# EAGLE design QuadGPS-v0.1 (EAGLE 5.06)
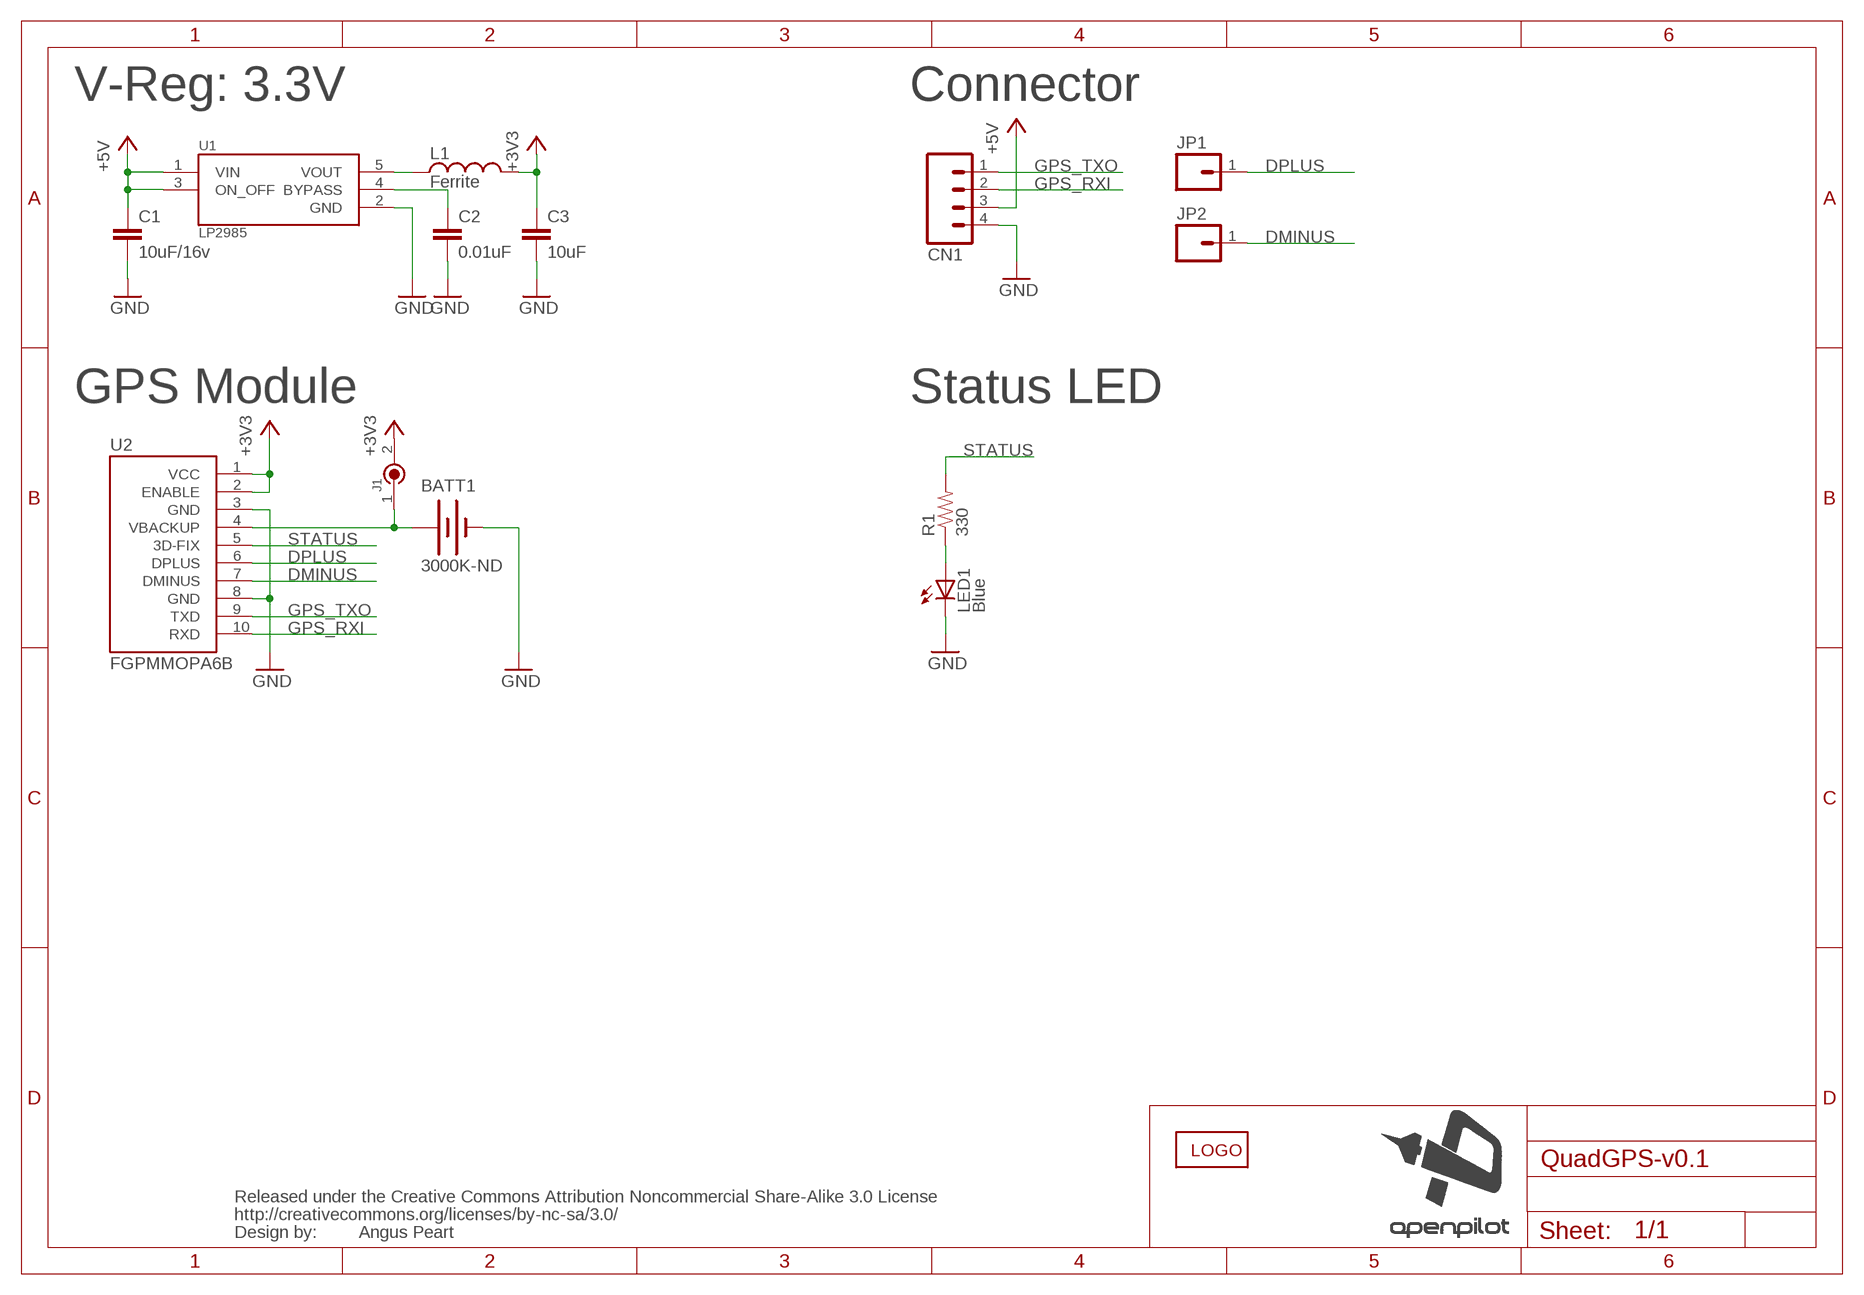
[diagram p0: schematic, sheet 1]

## Parts
BATT1  3000K-ND  BATTERY12MM-SMD  [COINCELL_12MM]
C1  10uF/16v  CAPACITOR0805  [0805]
C2  0.01uF  CAPACITOR0603  [0603]
C3  10uF  CAPACITOR0805  [0805]
CC  CREATIVE_COMMONS  [CREATIVE_COMMONS]
CN1  SM04B-SRSS-TB  [SM04B-SRSS-TB]
J1  JUMPER-ROUND  [JUMPER-ROUND]
JP1  PAD-0.06  [PAD-0.06]
JP2  PAD-0.06  [PAD-0.06]
L1  Ferrite  INDUCTOR0603  [0603]
LED1  Blue  LED0603  [LED-0603]
R1  330  RESISTOR0603  [0603]
U1  LP2985  [SOT-23-5]
U2  FGPMMOPA6B  [GTOP-FGPMMOPA6B]
U$1  LOGO_BRD_GPS_BOT  [LOGO-GPS-BOT]

## Nets
+3V3: C3.1 J1.2 L1.2 U2.1(VCC) U2.2(ENABLE)
+5V: C1.1 CN1.3 U1.1(VIN) U1.3(ON_OFF)
DMINUS: JP2.1 U2.7(DMINUS)
DPLUS: JP1.1 U2.6(DPLUS)
GND: BATT1.GND(-) C1.2 C2.2 C3.2 CN1.4 LED1.C U1.2(GND) U2.3(GND) U2.8(GND)
GPS_RXI: CN1.2 U2.10(RXD)
GPS_TXO: CN1.1 U2.9(TXD)
N$1: BATT1.PWR@1(+) J1.1 U2.4(VBACKUP)
N$2: C2.1 U1.4(BYPASS)
N$3: L1.1 U1.5(VOUT)
N$4: LED1.A R1.1
STATUS: R1.2 U2.5(3D-FIX)

## Notes on the sheet
- V-Reg: 3.3V | Connector
- GPS Module | Status LED
- Angus Peart

## Library data of the parts
BATT1 = OpenPilot:BATTERY: Battery 12mm coin cell
C1-C3 = OpenPilot:CAPACITOR: Capacitor Standard SMD ceramic capacitors.
CC = OpenPilot:CREATIVE_COMMONS: Creative Commons Licenses http://creativecommons.org/licenses/
CN1 = OpenPilot:SM04B-SRSS-TB: JST SR Connector 4 pins, SMT (Side entry)
J1 = OpenPilot:JUMPER: Simple Solder Jumpers
JP1 JP2 = OpenPilot:PAD-
L1 = OpenPilot:INDUCTOR
LED1 = OpenPilot:LED: Standard packages for surface mount Light Emitting Diodes (LEDs).
R1 = OpenPilot:RESISTOR: Resistor Basic schematic elements and footprints for 0603 resistors.
U1 = OpenPilot:LP2985: National Semiconductor LP2985 Micropower 150 mA Low-Noise Ultra Low-Dropout Regulator in SOT-23 and micro SMD Packages
U2 = OpenPilot:FGPMMOPA6B: GTOP FGPMMOPA6B GPS POT (Patch-On-Top) Module 66-channel GPS Engine Board
U$1 = OpenPilot:LOGO_BRD: Various logos used in the OpenPilot PCB designs.

## Board
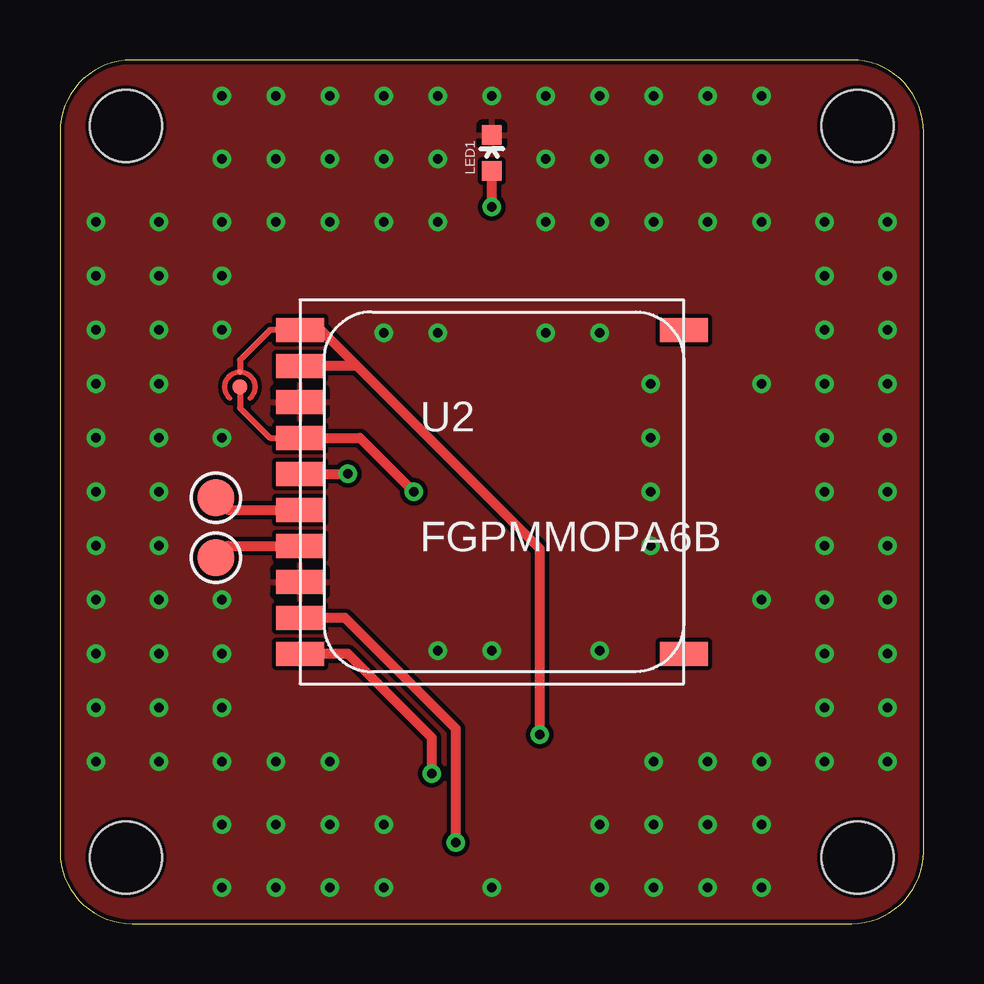
[diagram p1: board, top side]
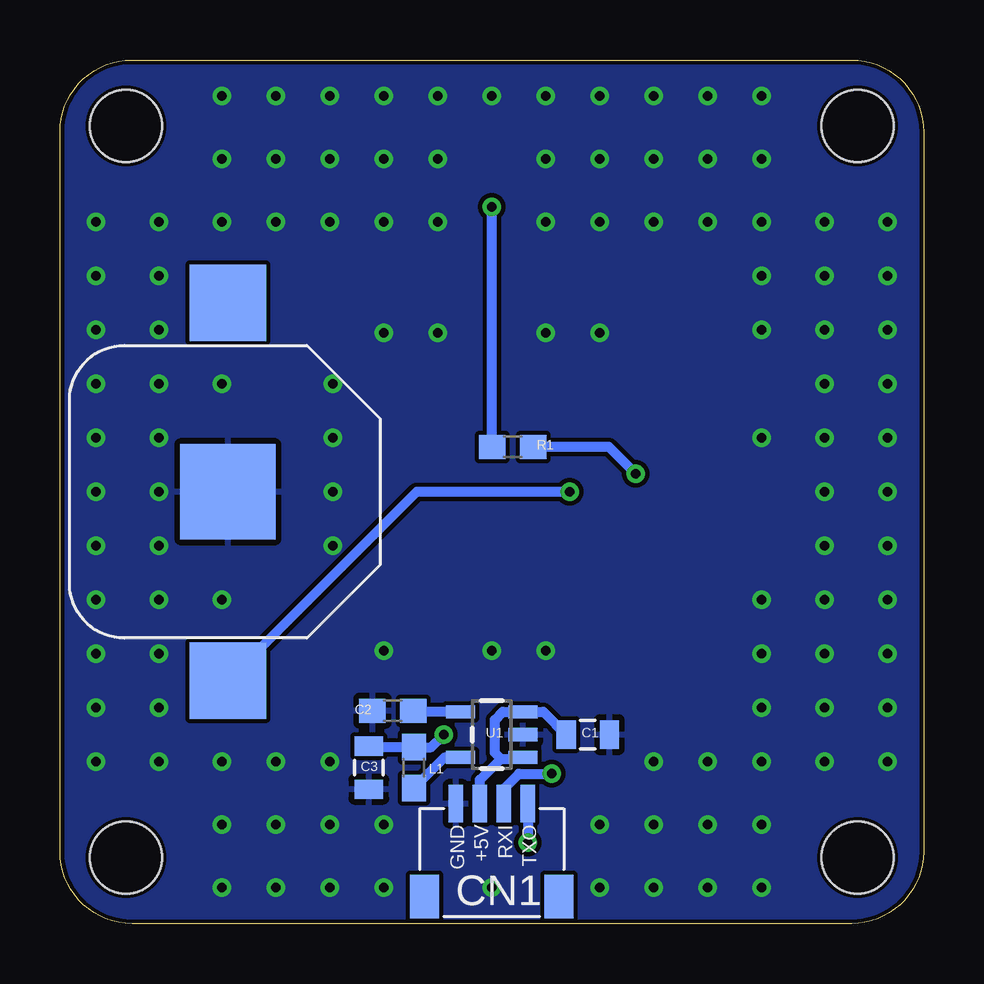
[diagram p2: board, bottom side, seen from below]

Size 36 x 36 mm. Coordinates in mm from the lower left corner, seen from the top.
Outline: 3,36 arc90 0,33 0,3 arc90 3,0 33,0 arc90 36,3 36,33 arc90 33,36 3,36
Copper layers (1*16): Top 0.0356mm / dielectric 1.5011mm / Bottom 0.0356mm
Design rules "7mils GUS Engineering *": minimum track width 7mil, minimum drill 15mil, track to track 7mil, track to pad 7mil, pad to pad 7mil, via to via 7mil, smd to smd 7mil, copper to edge 7mil, drill to drill 7mil, minimum pad ring 10mil, minimum via ring 8mil, stop-mask expansion 4mil, vias tented up to drill 25mil, thermal gap 10mil
Holes 3 mm at 2.75,2.75 2.75,33.25 33.25,33.25 33.25,2.75

### Footprints (pad centres in the part's own frame; a part is rotated, then mirrored left to right if it is on the bottom)
COINCELL_12MM = smd 3.962 x 3.962: GND 0,0 | smd 3.175 x 3.175: PWR@1 -7.874,0; PWR@2 7.874,0
0805 = smd 0.8 x 1.2: 1 -0.9,0; 2 0.9,0
0603 = smd 1.1 x 1: 1 -0.85,0; 2 0.85,0
SM04B-SRSS-TB = smd 0.6 x 1.55: 1 3,0; 2 2,0; 3 1,0; 4 0,0 | smd 1.2 x 1.8: NC@1 -1.3,-3.875; NC@2 4.3,-3.875
JUMPER-ROUND = smd 0.61 x 0.61: 1 0,0 | smd 0.203 x 0.203: 2 0,0.617
PAD-0.06 = smd 1.524 x 1.524: 1 0,0
LED-0603 = smd 0.8 x 0.8: A 0,-0.75; C 0,0.75
SOT-23-5 = smd 0.55 x 1.2: 1 -0.95,-1.3; 2 0,-1.3; 3 0.95,-1.3; 4 0.95,1.3; 5 -0.95,1.3
GTOP-FGPMMOPA6B = smd 2 x 1: 1 -8,6.75; 2 -8,5.25; 3 -8,3.75; 4 -8,2.25; 5 -8,0.75; 6 -8,-0.75; 7 -8,-2.25; 8 -8,-3.75; 9 -8,-5.25; 10 -8,-6.75; 11 8,-6.75; 12 8,6.75

### Placement (x,y rotation side)
BATT1  29,18 90 bottom
C1  14,7.88 0 bottom
C2  22.12,8.88 180 bottom
C3  23.12,6.5 270 bottom
CC  -123.25,11.5 0 top  (outside the outline)
CN1  19.5,5 0 bottom
J1  7.5,22.38 0 top
JP1  6.5,17.75 0 top
JP2  6.5,15.25 0 top
L1  21.25,6.5 90 bottom
LED1  18,32.12 0 top
R1  17.12,19.88 0 bottom
U1  18,7.88 90 bottom
U2  18,18 0 top
U$1  21.75,11.62 0 bottom

### Tracks (layer width: path | path; a pad name or v marks a point on that pad's centre or on a via)
+3V3  (via drill 0.38)
  Top 0.254: U2.1 8.75,24.75 7.5,23.5 J1.2
  Top 0.406: 12.38,23.25 10.88,24.75 U2.1 | 12.38,23.25 20,15.62 v20,7.88 | 12.38,23.25 U2.2
  Bottom 0.406: v20,7.88 20.52,7.35 L1.2 23.07,7.35 C3.1
+5V
  Bottom 0.406: CN1.3 18.5,6 17.62,6.88 | 17.62,6.88 16.75,6.88 U1.1 | 17.62,6.88 17.88,7.12 17.88,8.5 17.55,8.82 U1.3 15.85,8.82 C1.1
DMINUS
  Top 0.406: U2.7 7,15.75 JP2.1
DPLUS
  Top 0.406: U2.6 7,17.25 JP1.1
GND  (via drill 0.38)
  other vias: 1.5,27 1.5,22.5 1.5,18 1.5,13.5 1.5,9 1.5,11.25 1.5,15.75 1.5,20.25 1.5,24.75 1.5,29.25 1.5,6.75 34.5,27 34.5,22.5 34.5,18 34.5,13.5 34.5,9 34.5,11.25 34.5,15.75 34.5,20.25 34.5,24.75 34.5,29.25 34.5,6.75 9,34.5 13.5,34.5 18,34.5 22.5,34.5 27,34.5 24.75,34.5 20.25,34.5 15.75,34.5 11.25,34.5 6.75,34.5 29.25,34.5 27,1.5 22.5,1.5 18,1.5 13.5,1.5 9,1.5 11.25,1.5 24.75,1.5 29.25,1.5 6.75,1.5 6.75,9 6.75,13.5 6.75,27 6.75,24.75 6.75,20.25 6.75,11.25 29.25,13.5 29.25,22.5 29.25,6.75 9,29.25 13.5,29.25 22.5,29.25 27,29.25 24.75,29.25 20.25,29.25 15.75,29.25 11.25,29.25 6.75,29.25 29.25,29.25 9,6.75 27,6.75 24.75,6.75 11.25,6.75 6.75,6.75 9,31.88 13.5,31.88 22.5,31.88 27,31.88 24.75,31.88 20.25,31.88 15.75,31.88 11.25,31.88 6.75,31.88 29.25,31.88 31.88,9 31.88,13.5 31.88,18 31.88,22.5 31.88,27 31.88,24.75 31.88,20.25 31.88,15.75 31.88,11.25 31.88,6.75 31.88,29.25 9,4.12 13.5,4.12 22.5,4.12 27,4.12 24.75,4.12 11.25,4.12 6.75,4.12 29.25,4.12 4.12,9 4.12,13.5 4.12,18 4.12,22.5 4.12,27 4.12,24.75 4.12,20.25 4.12,15.75 4.12,11.25 4.12,6.75 4.12,29.25 13.5,24.62 22.5,24.62 20.25,24.62 15.75,24.62 24.62,22.5 24.62,15.75 24.62,20.25 22.5,11.38 18,11.38 15.75,11.38 24.62,18
  pour Bottom: 0,0 0,36 36,36 36,0
  pour Top: 0,0 0,36 36,36 36,0
GPS_RXI  (via drill 0.38)
  Top 0.406: U2.10 12,11.25 15.5,7.75 v15.5,6.25
  Bottom 0.406: v15.5,6.25 16.88,6.25 17.5,5.62 CN1.2
GPS_TXO  (via drill 0.38)
  Top 0.406: U2.9 11.88,12.75 16.5,8.12 v16.5,3.38
  Bottom 0.406: CN1.1 v16.5,3.38
N$1  (via drill 0.38)
  Top 0.254: J1.1 7.5,21.5 8.75,20.25 U2.4
  Top 0.406: U2.4 12.5,20.25 v14.75,18
  Bottom 0.406: BATT1.PWR@1 21.13,18 v14.75,18
N$2
  Bottom 0.406: U1.4 21.23,8.82 C2.1
N$3
  Bottom 0.406: U1.5 19.98,6.92 L1.1
N$4  (via drill 0.38)
  Top 0.406: v18,29.88 LED1.A
  Bottom 0.406: v18,29.88 18,19.9 R1.1
STATUS  (via drill 0.38)
  Top 0.406: U2.5 v12,18.75
  Bottom 0.406: v12,18.75 13.12,19.88 R1.2

### Text on the board
bNames: TXO | RXI | +5V | GND
Document: Angus Peart